# EAGLE design matrix (EAGLE 6.2)
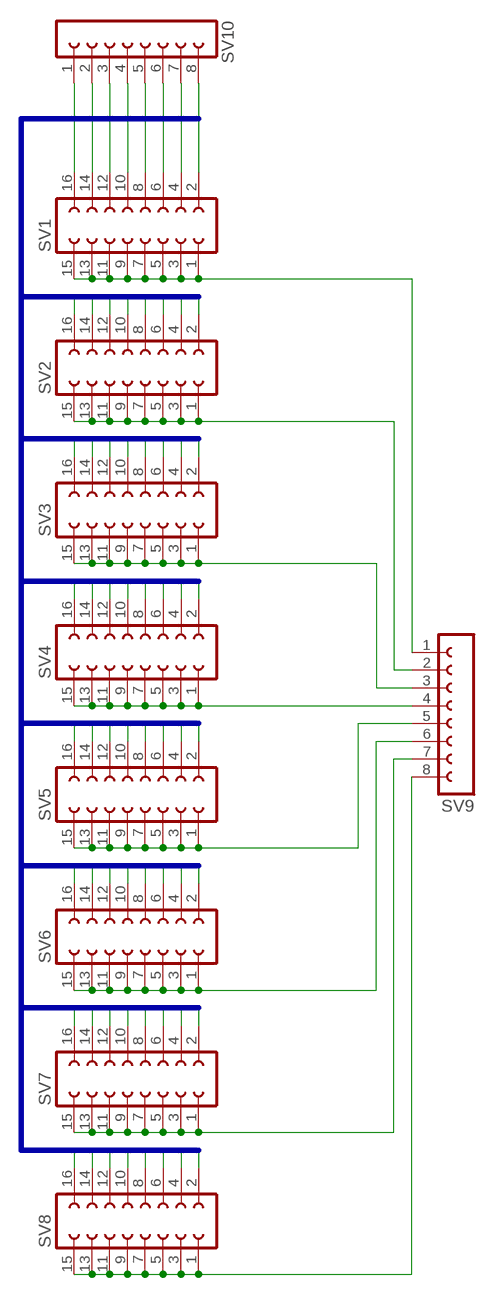
[diagram p0: schematic, sheet 1]

## Parts
SV1  FE08-2  [FE08-2]
SV2  FE08-2  [FE08-2]
SV3  FE08-2  [FE08-2]
SV4  FE08-2  [FE08-2]
SV5  FE08-2  [FE08-2]
SV6  FE08-2  [FE08-2]
SV7  FE08-2  [FE08-2]
SV8  FE08-2  [FE08-2]
SV9  FE08-1  [FE08]
SV10  FE08-1  [FE08]

## Nets
C1: SV1.16 SV2.16 SV3.16 SV4.16 SV5.16 SV6.16 SV7.16 SV8.16 SV10.1
C2: SV1.14 SV2.14 SV3.14 SV4.14 SV5.14 SV6.14 SV7.14 SV8.14 SV10.2
C3: SV1.12 SV2.12 SV3.12 SV4.12 SV5.12 SV6.12 SV7.12 SV8.12 SV10.3
C4: SV1.10 SV2.10 SV3.10 SV4.10 SV5.10 SV6.10 SV7.10 SV8.10 SV10.4
C5: SV1.8 SV2.8 SV3.8 SV4.8 SV5.8 SV6.8 SV7.8 SV8.8 SV10.5
C6: SV1.6 SV2.6 SV3.6 SV4.6 SV5.6 SV6.6 SV7.6 SV8.6 SV10.6
C7: SV1.4 SV2.4 SV3.4 SV4.4 SV5.4 SV6.4 SV7.4 SV8.4 SV10.7
C8: SV1.2 SV2.2 SV3.2 SV4.2 SV5.2 SV6.2 SV7.2 SV8.2 SV10.8
N$1: SV1.1 SV1.3 SV1.5 SV1.7 SV1.9 SV1.11 SV1.13 SV1.15 SV9.1
N$2: SV2.1 SV2.3 SV2.5 SV2.7 SV2.9 SV2.11 SV2.13 SV2.15 SV9.2
N$3: SV3.1 SV3.3 SV3.5 SV3.7 SV3.9 SV3.11 SV3.13 SV3.15 SV9.3
N$4: SV4.1 SV4.3 SV4.5 SV4.7 SV4.9 SV4.11 SV4.13 SV4.15 SV9.4
N$5: SV5.1 SV5.3 SV5.5 SV5.7 SV5.9 SV5.11 SV5.13 SV5.15 SV9.5
N$6: SV6.1 SV6.3 SV6.5 SV6.7 SV6.9 SV6.11 SV6.13 SV6.15 SV9.6
N$7: SV7.1 SV7.3 SV7.5 SV7.7 SV7.9 SV7.11 SV7.13 SV7.15 SV9.7
N$8: SV8.1 SV8.3 SV8.5 SV8.7 SV8.9 SV8.11 SV8.13 SV8.15 SV9.8

## Buses
C1,C2,C3,C4,C5,C6,C7,C8

## Library data of the parts
SV1-SV8 = con-lsta:FE08-2: FEMALE HEADER; OC_FARNELL: unknown; OC_NEWARK: unknown
SV9 SV10 = con-lsta:FE08-1: FEMALE HEADER; OC_FARNELL: unknown; OC_NEWARK: unknown

## Board
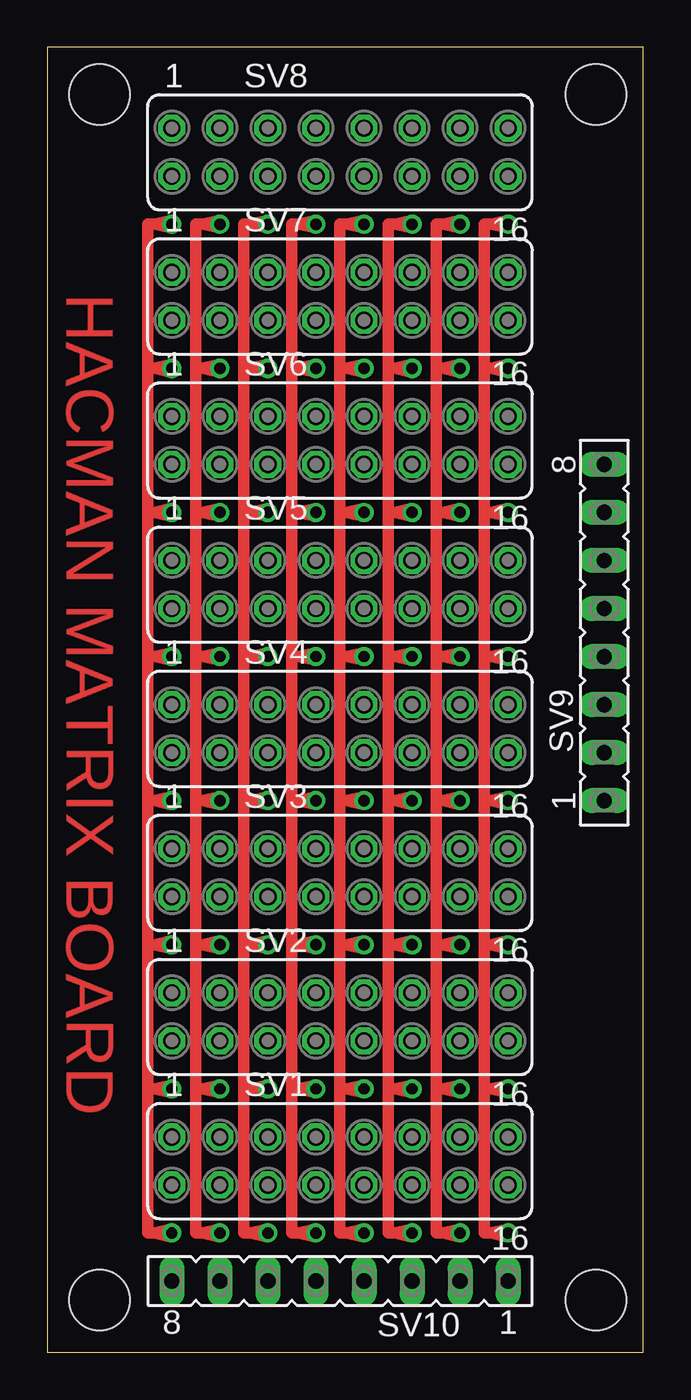
[diagram p1: board, top side]
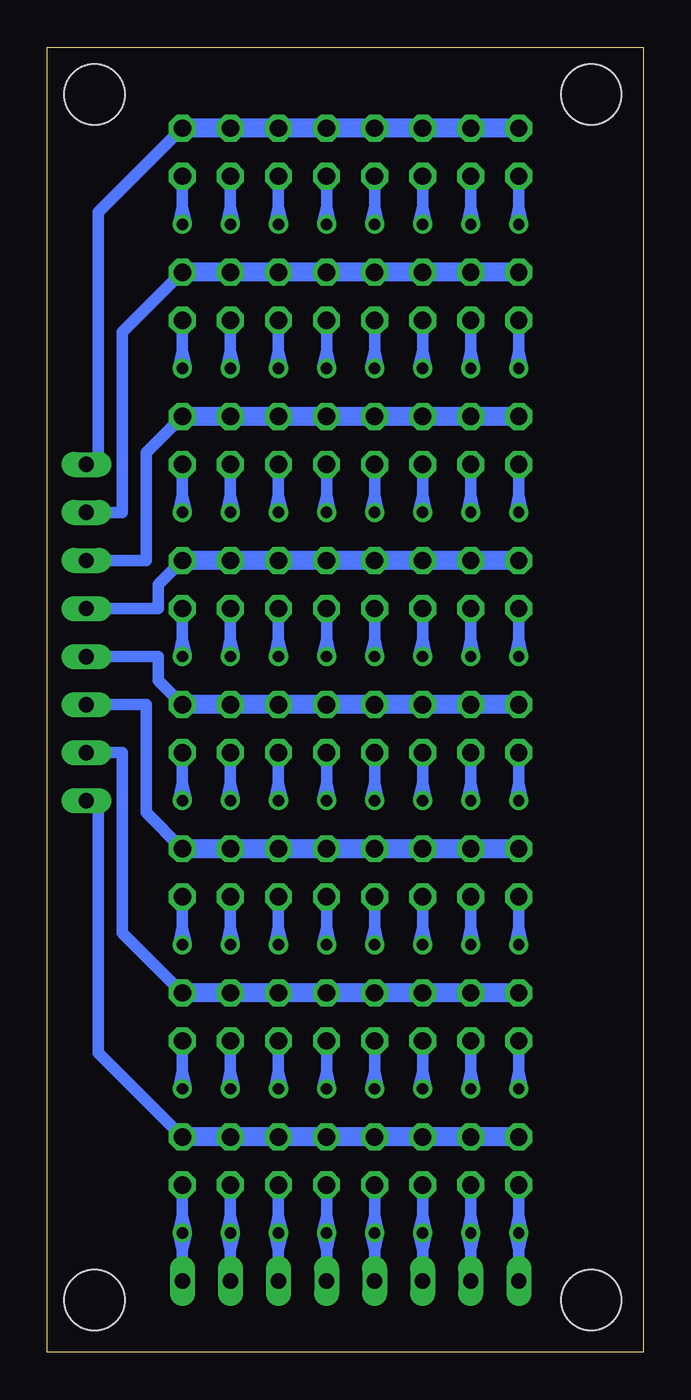
[diagram p2: board, bottom side, seen from below]

Size 31.5 x 69 mm. Coordinates in mm from the lower left corner, seen from the top.
Outline: 0,0 31.5,0 31.5,69 0,69 0,0
Copper layers (1*16): Top 0.035mm / dielectric 1.5mm / Bottom 0.035mm
Design rules: minimum track width 10mil, minimum drill 0.6mm, track to track 8mil, track to pad 8mil, pad to pad 8mil, via to via 8mil, smd to smd 8mil, copper to edge 40mil, drill to drill 8mil, minimum pad ring 10mil, minimum via ring 8mil, stop-mask expansion 4mil, vias tented up to drill 0mil, thermal gap 10mil
Holes 3.2 mm at 29,2.77 29,66.5 2.75,66.5 2.75,2.77

### Footprints (pad centres in the part's own frame; a part is rotated, then mirrored left to right if it is on the bottom)
FE08-2 = drill 0.914 octagon: 1 -8.89,1.27; 2 -8.89,-1.27; 3 -6.35,1.27; 4 -6.35,-1.27; 5 -3.81,1.27; 6 -3.81,-1.27; 7 -1.27,1.27; 8 -1.27,-1.27; 9 1.27,1.27; 10 1.27,-1.27; 11 3.81,1.27; 12 3.81,-1.27; 13 6.35,1.27; 14 6.35,-1.27; 15 8.89,1.27; 16 8.89,-1.27
FE08 = drill 0.813 long: 1 -8.89,0; 2 -6.35,0; 3 -3.81,0; 4 -1.27,0; 5 1.27,0; 6 3.81,0; 7 6.35,0; 8 8.89,0

### Placement (x,y rotation side)
SV1  15.47,10.11 0 top
SV2  15.47,17.73 0 top
SV3  15.47,25.35 0 top
SV4  15.47,32.97 0 top
SV5  15.47,40.59 0 top
SV6  15.47,48.21 0 top
SV7  15.47,55.83 0 top
SV8  15.47,63.45 0 top
SV9  29.44,38.05 90 top
SV10  15.47,3.76 180 top

### Tracks (layer width: path | path; a pad name or v marks a point on that pad's centre or on a via)
C1  (via drill 0.6)
  Top 0.61: 23.09,52.02 23.09,59.64 23.46,59.64 | 23.09,52.02 23.09,44.4 | 23.09,44.4 23.09,36.78 | 23.09,36.78 23.09,29.16 | 23.09,29.16 23.09,21.54 | 23.09,21.54 23.09,13.92 | 23.09,13.92 23.09,6.3 23.46,6.3 | v24.36,59.64 23.46,59.64 | v24.36,52.02 23.46,52.02 | 23.46,52.02 23.09,52.02 | v24.36,44.4 23.46,44.4 | 23.46,44.4 23.09,44.4 | v24.36,36.78 23.46,36.78 | 23.46,36.78 23.09,36.78 | v24.36,29.16 23.46,29.16 | 23.46,29.16 23.09,29.16 | v24.36,21.54 23.46,21.54 | 23.46,21.54 23.09,21.54 | v24.36,13.92 23.46,13.92 | 23.46,13.92 23.09,13.92 | v24.36,6.3 23.46,6.3 | 23.46,59.64 24.32,59.45 v24.36,59.64 | 23.46,59.64 24.32,59.84 v24.36,59.64 | 23.46,52.02 24.32,51.83 v24.36,52.02 | 23.46,52.02 24.32,52.22 v24.36,52.02 | 23.46,44.4 24.32,44.21 v24.36,44.4 | 23.46,44.4 24.32,44.6 v24.36,44.4 | 23.46,36.78 24.32,36.59 v24.36,36.78 | 23.46,36.78 24.32,36.98 v24.36,36.78 | 23.46,29.16 24.32,28.97 v24.36,29.16 | 23.46,29.16 24.32,29.36 v24.36,29.16 | 23.46,21.54 24.32,21.35 v24.36,21.54 | 23.46,21.54 24.32,21.74 v24.36,21.54 | 23.46,13.92 24.32,13.73 v24.36,13.92 | 23.46,13.92 24.32,14.12 v24.36,13.92 | 23.46,6.3 24.32,6.11 v24.36,6.3 | 23.46,6.3 24.32,6.5 v24.36,6.3
  Bottom 0.61: SV8.16 24.36,60.54 | 24.36,60.54 v24.36,59.64 | SV7.16 24.36,52.92 | 24.36,52.92 v24.36,52.02 | SV6.16 24.36,45.3 | 24.36,45.3 v24.36,44.4 | SV5.16 24.36,37.68 | 24.36,37.68 v24.36,36.78 | SV4.16 24.36,30.06 | 24.36,30.06 v24.36,29.16 | SV3.16 24.36,22.44 | 24.36,22.44 v24.36,21.54 | SV2.16 24.36,14.82 | 24.36,14.82 v24.36,13.92 | SV1.16 24.36,7.2 | 24.36,7.2 v24.36,6.3 | SV10.1 24.36,5.4 | 24.36,5.4 v24.36,6.3 | 24.36,60.54 24.17,59.69 v24.36,59.64 | 24.36,60.54 24.55,59.69 v24.36,59.64 | 24.36,52.92 24.17,52.07 v24.36,52.02 | 24.36,52.92 24.55,52.07 v24.36,52.02 | 24.36,45.3 24.17,44.45 v24.36,44.4 | 24.36,45.3 24.55,44.45 v24.36,44.4 | 24.36,37.68 24.17,36.83 v24.36,36.78 | 24.36,37.68 24.55,36.83 v24.36,36.78 | 24.36,30.06 24.17,29.21 v24.36,29.16 | 24.36,30.06 24.55,29.21 v24.36,29.16 | 24.36,22.44 24.17,21.59 v24.36,21.54 | 24.36,22.44 24.55,21.59 v24.36,21.54 | 24.36,14.82 24.17,13.97 v24.36,13.92 | 24.36,14.82 24.55,13.97 v24.36,13.92 | 24.36,7.2 24.17,6.35 v24.36,6.3 | 24.36,7.2 24.55,6.35 v24.36,6.3 | 24.36,5.4 24.55,6.26 v24.36,6.3 | 24.36,5.4 24.17,6.26 v24.36,6.3
C2  (via drill 0.6)
  Top 0.61: 20.55,52.02 20.55,59.64 20.92,59.64 | 20.55,52.02 20.55,44.4 | 20.55,44.4 20.55,36.78 | 20.55,36.78 20.55,29.16 | 20.55,29.16 20.55,21.54 | 20.55,21.54 20.55,13.92 | 20.55,13.92 20.55,6.3 20.92,6.3 | v21.82,59.64 20.92,59.64 | v21.82,52.02 20.92,52.02 | 20.92,52.02 20.55,52.02 | v21.82,44.4 20.92,44.4 | 20.92,44.4 20.55,44.4 | v21.82,36.78 20.92,36.78 | 20.92,36.78 20.55,36.78 | v21.82,29.16 20.92,29.16 | 20.92,29.16 20.55,29.16 | v21.82,21.54 20.92,21.54 | 20.92,21.54 20.55,21.54 | v21.82,13.92 20.92,13.92 | 20.92,13.92 20.55,13.92 | v21.82,6.3 20.92,6.3 | 20.92,59.64 21.78,59.45 v21.82,59.64 | 20.92,59.64 21.78,59.84 v21.82,59.64 | 20.92,52.02 21.78,51.83 v21.82,52.02 | 20.92,52.02 21.78,52.22 v21.82,52.02 | 20.92,44.4 21.78,44.21 v21.82,44.4 | 20.92,44.4 21.78,44.6 v21.82,44.4 | 20.92,36.78 21.78,36.59 v21.82,36.78 | 20.92,36.78 21.78,36.98 v21.82,36.78 | 20.92,29.16 21.78,28.97 v21.82,29.16 | 20.92,29.16 21.78,29.36 v21.82,29.16 | 20.92,21.54 21.78,21.35 v21.82,21.54 | 20.92,21.54 21.78,21.74 v21.82,21.54 | 20.92,13.92 21.78,13.73 v21.82,13.92 | 20.92,13.92 21.78,14.12 v21.82,13.92 | 20.92,6.3 21.78,6.11 v21.82,6.3 | 20.92,6.3 21.78,6.5 v21.82,6.3
  Bottom 0.61: SV8.14 21.82,60.54 | 21.82,60.54 v21.82,59.64 | SV7.14 21.82,52.92 | 21.82,52.92 v21.82,52.02 | SV6.14 21.82,45.3 | 21.82,45.3 v21.82,44.4 | SV5.14 21.82,37.68 | 21.82,37.68 v21.82,36.78 | SV4.14 21.82,30.06 | 21.82,30.06 v21.82,29.16 | SV3.14 21.82,22.44 | 21.82,22.44 v21.82,21.54 | SV2.14 21.82,14.82 | 21.82,14.82 v21.82,13.92 | SV1.14 21.82,7.2 | 21.82,7.2 v21.82,6.3 | SV10.2 21.82,5.4 | 21.82,5.4 v21.82,6.3 | 21.82,60.54 21.63,59.69 v21.82,59.64 | 21.82,60.54 22.01,59.69 v21.82,59.64 | 21.82,52.92 21.63,52.07 v21.82,52.02 | 21.82,52.92 22.01,52.07 v21.82,52.02 | 21.82,45.3 21.63,44.45 v21.82,44.4 | 21.82,45.3 22.01,44.45 v21.82,44.4 | 21.82,37.68 21.63,36.83 v21.82,36.78 | 21.82,37.68 22.01,36.83 v21.82,36.78 | 21.82,30.06 21.63,29.21 v21.82,29.16 | 21.82,30.06 22.01,29.21 v21.82,29.16 | 21.82,22.44 21.63,21.59 v21.82,21.54 | 21.82,22.44 22.01,21.59 v21.82,21.54 | 21.82,14.82 21.63,13.97 v21.82,13.92 | 21.82,14.82 22.01,13.97 v21.82,13.92 | 21.82,7.2 21.63,6.35 v21.82,6.3 | 21.82,7.2 22.01,6.35 v21.82,6.3 | 21.82,5.4 22.01,6.26 v21.82,6.3 | 21.82,5.4 21.63,6.26 v21.82,6.3
C3  (via drill 0.6)
  Top 0.61: 18.01,52.02 18.01,59.64 18.38,59.64 | 18.01,52.02 18.01,44.4 | 18.01,44.4 18.01,36.78 | 18.01,36.78 18.01,29.16 | 18.01,29.16 18.01,21.54 | 18.01,21.54 18.01,13.92 | 18.01,13.92 18.01,6.3 18.38,6.3 | v19.28,59.64 18.38,59.64 | v19.28,52.02 18.38,52.02 | 18.38,52.02 18.01,52.02 | v19.28,44.4 18.38,44.4 | 18.38,44.4 18.01,44.4 | v19.28,36.78 18.38,36.78 | 18.38,36.78 18.01,36.78 | v19.28,29.16 18.38,29.16 | 18.38,29.16 18.01,29.16 | v19.28,21.54 18.38,21.54 | 18.38,21.54 18.01,21.54 | v19.28,13.92 18.38,13.92 | 18.38,13.92 18.01,13.92 | v19.28,6.3 18.38,6.3 | 18.38,59.64 19.24,59.45 v19.28,59.64 | 18.38,59.64 19.24,59.84 v19.28,59.64 | 18.38,52.02 19.24,51.83 v19.28,52.02 | 18.38,52.02 19.24,52.22 v19.28,52.02 | 18.38,44.4 19.24,44.21 v19.28,44.4 | 18.38,44.4 19.24,44.6 v19.28,44.4 | 18.38,36.78 19.24,36.59 v19.28,36.78 | 18.38,36.78 19.24,36.98 v19.28,36.78 | 18.38,29.16 19.24,28.97 v19.28,29.16 | 18.38,29.16 19.24,29.36 v19.28,29.16 | 18.38,21.54 19.24,21.35 v19.28,21.54 | 18.38,21.54 19.24,21.74 v19.28,21.54 | 18.38,13.92 19.24,13.73 v19.28,13.92 | 18.38,13.92 19.24,14.12 v19.28,13.92 | 18.38,6.3 19.24,6.11 v19.28,6.3 | 18.38,6.3 19.24,6.5 v19.28,6.3
  Bottom 0.61: SV8.12 19.28,60.54 | 19.28,60.54 v19.28,59.64 | SV7.12 19.28,52.92 | 19.28,52.92 v19.28,52.02 | SV6.12 19.28,45.3 | 19.28,45.3 v19.28,44.4 | SV5.12 19.28,37.68 | 19.28,37.68 v19.28,36.78 | SV4.12 19.28,30.06 | 19.28,30.06 v19.28,29.16 | SV3.12 19.28,22.44 | 19.28,22.44 v19.28,21.54 | SV2.12 19.28,14.82 | 19.28,14.82 v19.28,13.92 | SV1.12 19.28,7.2 | 19.28,7.2 v19.28,6.3 | SV10.3 19.28,5.4 | 19.28,5.4 v19.28,6.3 | 19.28,60.54 19.09,59.69 v19.28,59.64 | 19.28,60.54 19.47,59.69 v19.28,59.64 | 19.28,52.92 19.09,52.07 v19.28,52.02 | 19.28,52.92 19.47,52.07 v19.28,52.02 | 19.28,45.3 19.09,44.45 v19.28,44.4 | 19.28,45.3 19.47,44.45 v19.28,44.4 | 19.28,37.68 19.09,36.83 v19.28,36.78 | 19.28,37.68 19.47,36.83 v19.28,36.78 | 19.28,30.06 19.09,29.21 v19.28,29.16 | 19.28,30.06 19.47,29.21 v19.28,29.16 | 19.28,22.44 19.09,21.59 v19.28,21.54 | 19.28,22.44 19.47,21.59 v19.28,21.54 | 19.28,14.82 19.09,13.97 v19.28,13.92 | 19.28,14.82 19.47,13.97 v19.28,13.92 | 19.28,7.2 19.09,6.35 v19.28,6.3 | 19.28,7.2 19.47,6.35 v19.28,6.3 | 19.28,5.4 19.47,6.26 v19.28,6.3 | 19.28,5.4 19.09,6.26 v19.28,6.3
C4  (via drill 0.6)
  Top 0.61: 15.47,52.02 15.47,59.64 15.84,59.64 | 15.47,52.02 15.47,44.4 | 15.47,44.4 15.47,36.78 | 15.47,36.78 15.47,29.16 | 15.47,29.16 15.47,21.54 | 15.47,21.54 15.47,13.92 | 15.47,13.92 15.47,6.3 15.84,6.3 | v16.74,59.64 15.84,59.64 | v16.74,52.02 15.84,52.02 | 15.84,52.02 15.47,52.02 | v16.74,44.4 15.84,44.4 | 15.84,44.4 15.47,44.4 | v16.74,36.78 15.84,36.78 | 15.84,36.78 15.47,36.78 | v16.74,29.16 15.84,29.16 | 15.84,29.16 15.47,29.16 | v16.74,21.54 15.84,21.54 | 15.84,21.54 15.47,21.54 | v16.74,13.92 15.84,13.92 | 15.84,13.92 15.47,13.92 | v16.74,6.3 15.84,6.3 | 15.84,59.64 16.7,59.45 v16.74,59.64 | 15.84,59.64 16.7,59.84 v16.74,59.64 | 15.84,52.02 16.7,51.83 v16.74,52.02 | 15.84,52.02 16.7,52.22 v16.74,52.02 | 15.84,44.4 16.7,44.21 v16.74,44.4 | 15.84,44.4 16.7,44.6 v16.74,44.4 | 15.84,36.78 16.7,36.59 v16.74,36.78 | 15.84,36.78 16.7,36.98 v16.74,36.78 | 15.84,29.16 16.7,28.97 v16.74,29.16 | 15.84,29.16 16.7,29.36 v16.74,29.16 | 15.84,21.54 16.7,21.35 v16.74,21.54 | 15.84,21.54 16.7,21.74 v16.74,21.54 | 15.84,13.92 16.7,13.73 v16.74,13.92 | 15.84,13.92 16.7,14.12 v16.74,13.92 | 15.84,6.3 16.7,6.11 v16.74,6.3 | 15.84,6.3 16.7,6.5 v16.74,6.3
  Bottom 0.61: SV8.10 16.74,60.54 | 16.74,60.54 v16.74,59.64 | SV7.10 16.74,52.92 | 16.74,52.92 v16.74,52.02 | SV6.10 16.74,45.3 | 16.74,45.3 v16.74,44.4 | SV5.10 16.74,37.68 | 16.74,37.68 v16.74,36.78 | SV4.10 16.74,30.06 | 16.74,30.06 v16.74,29.16 | SV3.10 16.74,22.44 | 16.74,22.44 v16.74,21.54 | SV2.10 16.74,14.82 | 16.74,14.82 v16.74,13.92 | SV1.10 16.74,7.2 | 16.74,7.2 v16.74,6.3 | SV10.4 16.74,5.4 | 16.74,5.4 v16.74,6.3 | 16.74,60.54 16.55,59.69 v16.74,59.64 | 16.74,60.54 16.93,59.69 v16.74,59.64 | 16.74,52.92 16.55,52.07 v16.74,52.02 | 16.74,52.92 16.93,52.07 v16.74,52.02 | 16.74,45.3 16.55,44.45 v16.74,44.4 | 16.74,45.3 16.93,44.45 v16.74,44.4 | 16.74,37.68 16.55,36.83 v16.74,36.78 | 16.74,37.68 16.93,36.83 v16.74,36.78 | 16.74,30.06 16.55,29.21 v16.74,29.16 | 16.74,30.06 16.93,29.21 v16.74,29.16 | 16.74,22.44 16.55,21.59 v16.74,21.54 | 16.74,22.44 16.93,21.59 v16.74,21.54 | 16.74,14.82 16.55,13.97 v16.74,13.92 | 16.74,14.82 16.93,13.97 v16.74,13.92 | 16.74,7.2 16.55,6.35 v16.74,6.3 | 16.74,7.2 16.93,6.35 v16.74,6.3 | 16.74,5.4 16.93,6.26 v16.74,6.3 | 16.74,5.4 16.55,6.26 v16.74,6.3
C5  (via drill 0.6)
  Top 0.61: 12.93,52.02 12.93,59.64 13.3,59.64 | 12.93,52.02 12.93,44.4 | 12.93,44.4 12.93,36.78 | 12.93,36.78 12.93,29.16 | 12.93,29.16 12.93,21.54 | 12.93,21.54 12.93,13.92 | 12.93,13.92 12.93,6.3 13.3,6.3 | v14.2,59.64 13.3,59.64 | v14.2,52.02 13.3,52.02 | 13.3,52.02 12.93,52.02 | v14.2,44.4 13.3,44.4 | 13.3,44.4 12.93,44.4 | v14.2,36.78 13.3,36.78 | 13.3,36.78 12.93,36.78 | v14.2,29.16 13.3,29.16 | 13.3,29.16 12.93,29.16 | v14.2,21.54 13.3,21.54 | 13.3,21.54 12.93,21.54 | v14.2,13.92 13.3,13.92 | 13.3,13.92 12.93,13.92 | v14.2,6.3 13.3,6.3 | 13.3,59.64 14.16,59.45 v14.2,59.64 | 13.3,59.64 14.16,59.84 v14.2,59.64 | 13.3,52.02 14.16,51.83 v14.2,52.02 | 13.3,52.02 14.16,52.22 v14.2,52.02 | 13.3,44.4 14.16,44.21 v14.2,44.4 | 13.3,44.4 14.16,44.6 v14.2,44.4 | 13.3,36.78 14.16,36.59 v14.2,36.78 | 13.3,36.78 14.16,36.98 v14.2,36.78 | 13.3,29.16 14.16,28.97 v14.2,29.16 | 13.3,29.16 14.16,29.36 v14.2,29.16 | 13.3,21.54 14.16,21.35 v14.2,21.54 | 13.3,21.54 14.16,21.74 v14.2,21.54 | 13.3,13.92 14.16,13.73 v14.2,13.92 | 13.3,13.92 14.16,14.12 v14.2,13.92 | 13.3,6.3 14.16,6.11 v14.2,6.3 | 13.3,6.3 14.16,6.5 v14.2,6.3
  Bottom 0.61: SV8.8 14.2,60.54 | 14.2,60.54 v14.2,59.64 | SV7.8 14.2,52.92 | 14.2,52.92 v14.2,52.02 | SV6.8 14.2,45.3 | 14.2,45.3 v14.2,44.4 | SV5.8 14.2,37.68 | 14.2,37.68 v14.2,36.78 | SV4.8 14.2,30.06 | 14.2,30.06 v14.2,29.16 | SV3.8 14.2,22.44 | 14.2,22.44 v14.2,21.54 | SV2.8 14.2,14.82 | 14.2,14.82 v14.2,13.92 | SV1.8 14.2,7.2 | 14.2,7.2 v14.2,6.3 | SV10.5 14.2,5.4 | 14.2,5.4 v14.2,6.3 | 14.2,60.54 14.01,59.69 v14.2,59.64 | 14.2,60.54 14.39,59.69 v14.2,59.64 | 14.2,52.92 14.01,52.07 v14.2,52.02 | 14.2,52.92 14.39,52.07 v14.2,52.02 | 14.2,45.3 14.01,44.45 v14.2,44.4 | 14.2,45.3 14.39,44.45 v14.2,44.4 | 14.2,37.68 14.01,36.83 v14.2,36.78 | 14.2,37.68 14.39,36.83 v14.2,36.78 | 14.2,30.06 14.01,29.21 v14.2,29.16 | 14.2,30.06 14.39,29.21 v14.2,29.16 | 14.2,22.44 14.01,21.59 v14.2,21.54 | 14.2,22.44 14.39,21.59 v14.2,21.54 | 14.2,14.82 14.01,13.97 v14.2,13.92 | 14.2,14.82 14.39,13.97 v14.2,13.92 | 14.2,7.2 14.01,6.35 v14.2,6.3 | 14.2,7.2 14.39,6.35 v14.2,6.3 | 14.2,5.4 14.39,6.26 v14.2,6.3 | 14.2,5.4 14.01,6.26 v14.2,6.3
C6  (via drill 0.6)
  Top 0.61: 10.39,52.02 10.39,59.64 10.76,59.64 | 10.39,52.02 10.39,44.4 | 10.39,44.4 10.39,36.78 | 10.39,36.78 10.39,29.16 | 10.39,29.16 10.39,21.54 | 10.39,21.54 10.39,13.92 | 10.39,13.92 10.39,6.3 10.76,6.3 | v11.66,59.64 10.76,59.64 | v11.66,52.02 10.76,52.02 | 10.76,52.02 10.39,52.02 | v11.66,44.4 10.76,44.4 | 10.76,44.4 10.39,44.4 | v11.66,36.78 10.76,36.78 | 10.76,36.78 10.39,36.78 | v11.66,29.16 10.76,29.16 | 10.76,29.16 10.39,29.16 | v11.66,21.54 10.76,21.54 | 10.76,21.54 10.39,21.54 | v11.66,13.92 10.76,13.92 | 10.76,13.92 10.39,13.92 | v11.66,6.3 10.76,6.3 | 10.76,59.64 11.62,59.45 v11.66,59.64 | 10.76,59.64 11.62,59.84 v11.66,59.64 | 10.76,52.02 11.62,51.83 v11.66,52.02 | 10.76,52.02 11.62,52.22 v11.66,52.02 | 10.76,44.4 11.62,44.21 v11.66,44.4 | 10.76,44.4 11.62,44.6 v11.66,44.4 | 10.76,36.78 11.62,36.59 v11.66,36.78 | 10.76,36.78 11.62,36.98 v11.66,36.78 | 10.76,29.16 11.62,28.97 v11.66,29.16 | 10.76,29.16 11.62,29.36 v11.66,29.16 | 10.76,21.54 11.62,21.35 v11.66,21.54 | 10.76,21.54 11.62,21.74 v11.66,21.54 | 10.76,13.92 11.62,13.73 v11.66,13.92 | 10.76,13.92 11.62,14.12 v11.66,13.92 | 10.76,6.3 11.62,6.11 v11.66,6.3 | 10.76,6.3 11.62,6.5 v11.66,6.3
  Bottom 0.61: SV8.6 11.66,60.54 | 11.66,60.54 v11.66,59.64 | SV7.6 11.66,52.92 | 11.66,52.92 v11.66,52.02 | SV6.6 11.66,45.3 | 11.66,45.3 v11.66,44.4 | SV5.6 11.66,37.68 | 11.66,37.68 v11.66,36.78 | SV4.6 11.66,30.06 | 11.66,30.06 v11.66,29.16 | SV3.6 11.66,22.44 | 11.66,22.44 v11.66,21.54 | SV2.6 11.66,14.82 | 11.66,14.82 v11.66,13.92 | SV1.6 11.66,7.2 | 11.66,7.2 v11.66,6.3 | SV10.6 11.66,5.4 | 11.66,5.4 v11.66,6.3 | 11.66,60.54 11.47,59.69 v11.66,59.64 | 11.66,60.54 11.85,59.69 v11.66,59.64 | 11.66,52.92 11.47,52.07 v11.66,52.02 | 11.66,52.92 11.85,52.07 v11.66,52.02 | 11.66,45.3 11.47,44.45 v11.66,44.4 | 11.66,45.3 11.85,44.45 v11.66,44.4 | 11.66,37.68 11.47,36.83 v11.66,36.78 | 11.66,37.68 11.85,36.83 v11.66,36.78 | 11.66,30.06 11.47,29.21 v11.66,29.16 | 11.66,30.06 11.85,29.21 v11.66,29.16 | 11.66,22.44 11.47,21.59 v11.66,21.54 | 11.66,22.44 11.85,21.59 v11.66,21.54 | 11.66,14.82 11.47,13.97 v11.66,13.92 | 11.66,14.82 11.85,13.97 v11.66,13.92 | 11.66,7.2 11.47,6.35 v11.66,6.3 | 11.66,7.2 11.85,6.35 v11.66,6.3 | 11.66,5.4 11.85,6.26 v11.66,6.3 | 11.66,5.4 11.47,6.26 v11.66,6.3
C7  (via drill 0.6)
  Top 0.61: 7.85,52.02 7.85,59.64 8.22,59.64 | 7.85,52.02 7.85,44.4 | 7.85,44.4 7.85,36.78 | 7.85,36.78 7.85,29.16 | 7.85,29.16 7.85,21.54 | 7.85,21.54 7.85,13.92 | 7.85,13.92 7.85,6.3 8.22,6.3 | v9.12,59.64 8.22,59.64 | v9.12,52.02 8.22,52.02 | 8.22,52.02 7.85,52.02 | v9.12,44.4 8.22,44.4 | 8.22,44.4 7.85,44.4 | v9.12,36.78 8.22,36.78 | 8.22,36.78 7.85,36.78 | v9.12,29.16 8.22,29.16 | 8.22,29.16 7.85,29.16 | v9.12,21.54 8.22,21.54 | 8.22,21.54 7.85,21.54 | v9.12,13.92 8.22,13.92 | 8.22,13.92 7.85,13.92 | v9.12,6.3 8.22,6.3 | 8.22,59.64 9.08,59.45 v9.12,59.64 | 8.22,59.64 9.08,59.84 v9.12,59.64 | 8.22,52.02 9.08,51.83 v9.12,52.02 | 8.22,52.02 9.08,52.22 v9.12,52.02 | 8.22,44.4 9.08,44.21 v9.12,44.4 | 8.22,44.4 9.08,44.6 v9.12,44.4 | 8.22,36.78 9.08,36.59 v9.12,36.78 | 8.22,36.78 9.08,36.98 v9.12,36.78 | 8.22,29.16 9.08,28.97 v9.12,29.16 | 8.22,29.16 9.08,29.36 v9.12,29.16 | 8.22,21.54 9.08,21.35 v9.12,21.54 | 8.22,21.54 9.08,21.74 v9.12,21.54 | 8.22,13.92 9.08,13.73 v9.12,13.92 | 8.22,13.92 9.08,14.12 v9.12,13.92 | 8.22,6.3 9.08,6.11 v9.12,6.3 | 8.22,6.3 9.08,6.5 v9.12,6.3
  Bottom 0.61: SV8.4 9.12,60.54 | 9.12,60.54 v9.12,59.64 | SV7.4 9.12,52.92 | 9.12,52.92 v9.12,52.02 | SV6.4 9.12,45.3 | 9.12,45.3 v9.12,44.4 | SV5.4 9.12,37.68 | 9.12,37.68 v9.12,36.78 | SV4.4 9.12,30.06 | 9.12,30.06 v9.12,29.16 | SV3.4 9.12,22.44 | 9.12,22.44 v9.12,21.54 | SV2.4 9.12,14.82 | 9.12,14.82 v9.12,13.92 | SV1.4 9.12,7.2 | 9.12,7.2 v9.12,6.3 | SV10.7 9.12,5.4 | 9.12,5.4 v9.12,6.3 | 9.12,60.54 8.93,59.69 v9.12,59.64 | 9.12,60.54 9.31,59.69 v9.12,59.64 | 9.12,52.92 8.93,52.07 v9.12,52.02 | 9.12,52.92 9.31,52.07 v9.12,52.02 | 9.12,45.3 8.93,44.45 v9.12,44.4 | 9.12,45.3 9.31,44.45 v9.12,44.4 | 9.12,37.68 8.93,36.83 v9.12,36.78 | 9.12,37.68 9.31,36.83 v9.12,36.78 | 9.12,30.06 8.93,29.21 v9.12,29.16 | 9.12,30.06 9.31,29.21 v9.12,29.16 | 9.12,22.44 8.93,21.59 v9.12,21.54 | 9.12,22.44 9.31,21.59 v9.12,21.54 | 9.12,14.82 8.93,13.97 v9.12,13.92 | 9.12,14.82 9.31,13.97 v9.12,13.92 | 9.12,7.2 8.93,6.35 v9.12,6.3 | 9.12,7.2 9.31,6.35 v9.12,6.3 | 9.12,5.4 9.31,6.26 v9.12,6.3 | 9.12,5.4 8.93,6.26 v9.12,6.3
C8  (via drill 0.6)
  Top 0.61: 5.31,52.02 5.31,59.64 5.68,59.64 | 5.31,52.02 5.31,44.4 | 5.31,44.4 5.31,36.78 | 5.31,36.78 5.31,29.16 | 5.31,29.16 5.31,21.54 | 5.31,21.54 5.31,13.92 | 5.31,13.92 5.31,6.3 5.68,6.3 | v6.58,59.64 5.68,59.64 | v6.58,52.02 5.68,52.02 | 5.68,52.02 5.31,52.02 | v6.58,44.4 5.68,44.4 | 5.68,44.4 5.31,44.4 | v6.58,36.78 5.68,36.78 | 5.68,36.78 5.31,36.78 | v6.58,29.16 5.68,29.16 | 5.68,29.16 5.31,29.16 | v6.58,21.54 5.68,21.54 | 5.68,21.54 5.31,21.54 | v6.58,13.92 5.68,13.92 | 5.68,13.92 5.31,13.92 | v6.58,6.3 5.68,6.3 | 5.68,59.64 6.54,59.45 v6.58,59.64 | 5.68,59.64 6.54,59.84 v6.58,59.64 | 5.68,52.02 6.54,51.83 v6.58,52.02 | 5.68,52.02 6.54,52.22 v6.58,52.02 | 5.68,44.4 6.54,44.21 v6.58,44.4 | 5.68,44.4 6.54,44.6 v6.58,44.4 | 5.68,36.78 6.54,36.59 v6.58,36.78 | 5.68,36.78 6.54,36.98 v6.58,36.78 | 5.68,29.16 6.54,28.97 v6.58,29.16 | 5.68,29.16 6.54,29.36 v6.58,29.16 | 5.68,21.54 6.54,21.35 v6.58,21.54 | 5.68,21.54 6.54,21.74 v6.58,21.54 | 5.68,13.92 6.54,13.73 v6.58,13.92 | 5.68,13.92 6.54,14.12 v6.58,13.92 | 5.68,6.3 6.54,6.11 v6.58,6.3 | 5.68,6.3 6.54,6.5 v6.58,6.3
  Bottom 0.61: SV8.2 6.58,60.54 | 6.58,60.54 v6.58,59.64 | SV7.2 6.58,52.92 | 6.58,52.92 v6.58,52.02 | SV6.2 6.58,45.3 | 6.58,45.3 v6.58,44.4 | SV5.2 6.58,37.68 | 6.58,37.68 v6.58,36.78 | SV4.2 6.58,30.06 | 6.58,30.06 v6.58,29.16 | SV3.2 6.58,22.44 | 6.58,22.44 v6.58,21.54 | SV2.2 6.58,14.82 | 6.58,14.82 v6.58,13.92 | SV1.2 6.58,7.2 | 6.58,7.2 v6.58,6.3 | SV10.8 6.58,5.4 | 6.58,5.4 v6.58,6.3 | 6.58,60.54 6.39,59.69 v6.58,59.64 | 6.58,60.54 6.77,59.69 v6.58,59.64 | 6.58,52.92 6.39,52.07 v6.58,52.02 | 6.58,52.92 6.77,52.07 v6.58,52.02 | 6.58,45.3 6.39,44.45 v6.58,44.4 | 6.58,45.3 6.77,44.45 v6.58,44.4 | 6.58,37.68 6.39,36.83 v6.58,36.78 | 6.58,37.68 6.77,36.83 v6.58,36.78 | 6.58,30.06 6.39,29.21 v6.58,29.16 | 6.58,30.06 6.77,29.21 v6.58,29.16 | 6.58,22.44 6.39,21.59 v6.58,21.54 | 6.58,22.44 6.77,21.59 v6.58,21.54 | 6.58,14.82 6.39,13.97 v6.58,13.92 | 6.58,14.82 6.77,13.97 v6.58,13.92 | 6.58,7.2 6.39,6.35 v6.58,6.3 | 6.58,7.2 6.77,6.35 v6.58,6.3 | 6.58,5.4 6.77,6.26 v6.58,6.3 | 6.58,5.4 6.39,6.26 v6.58,6.3
N$1
  Bottom 0.61: SV1.15 28.8,15.83 28.8,29.16 SV9.1
  Bottom 1.016: SV1.1 SV1.3 SV1.5 SV1.7 SV1.9 SV1.11 SV1.13 SV1.15
N$2
  Bottom 0.61: SV2.15 27.54,22.18 27.54,31.7 SV9.2
  Bottom 1.016: SV2.1 SV2.3 SV2.5 SV2.7 SV2.9 SV2.11 SV2.13 SV2.15
N$3
  Bottom 0.61: SV3.15 26.27,28.53 26.27,34.24 SV9.3
  Bottom 1.016: SV3.1 SV3.3 SV3.5 SV3.7 SV3.9 SV3.11 SV3.13 SV3.15
N$4
  Bottom 0.61: SV9.4 25.63,36.78 25.63,35.51 SV4.15
  Bottom 1.016: SV4.1 SV4.3 SV4.5 SV4.7 SV4.9 SV4.11 SV4.13 SV4.15
N$5
  Bottom 0.61: SV9.5 25.63,39.32 25.63,40.59 SV5.15
  Bottom 1.016: SV5.1 SV5.3 SV5.5 SV5.7 SV5.9 SV5.11 SV5.13 SV5.15
N$6
  Bottom 0.61: SV6.15 26.27,47.58 26.27,41.86 SV9.6
  Bottom 1.016: SV6.1 SV6.3 SV6.5 SV6.7 SV6.9 SV6.11 SV6.13 SV6.15
N$7
  Bottom 0.61: SV7.15 27.54,53.93 27.54,44.4 SV9.7
  Bottom 1.016: SV7.1 SV7.3 SV7.5 SV7.7 SV7.9 SV7.11 SV7.13 SV7.15
N$8
  Bottom 0.61: SV8.15 28.8,60.28 28.8,46.94 SV9.8
  Bottom 1.016: SV8.1 SV8.3 SV8.5 SV8.7 SV8.9 SV8.11 SV8.13 SV8.15

### Text on the board
Top: HACMAN MATRIX BOARD